# EAGLE design USBSocket_Type1_v1.0 (EAGLE 9.6.2)
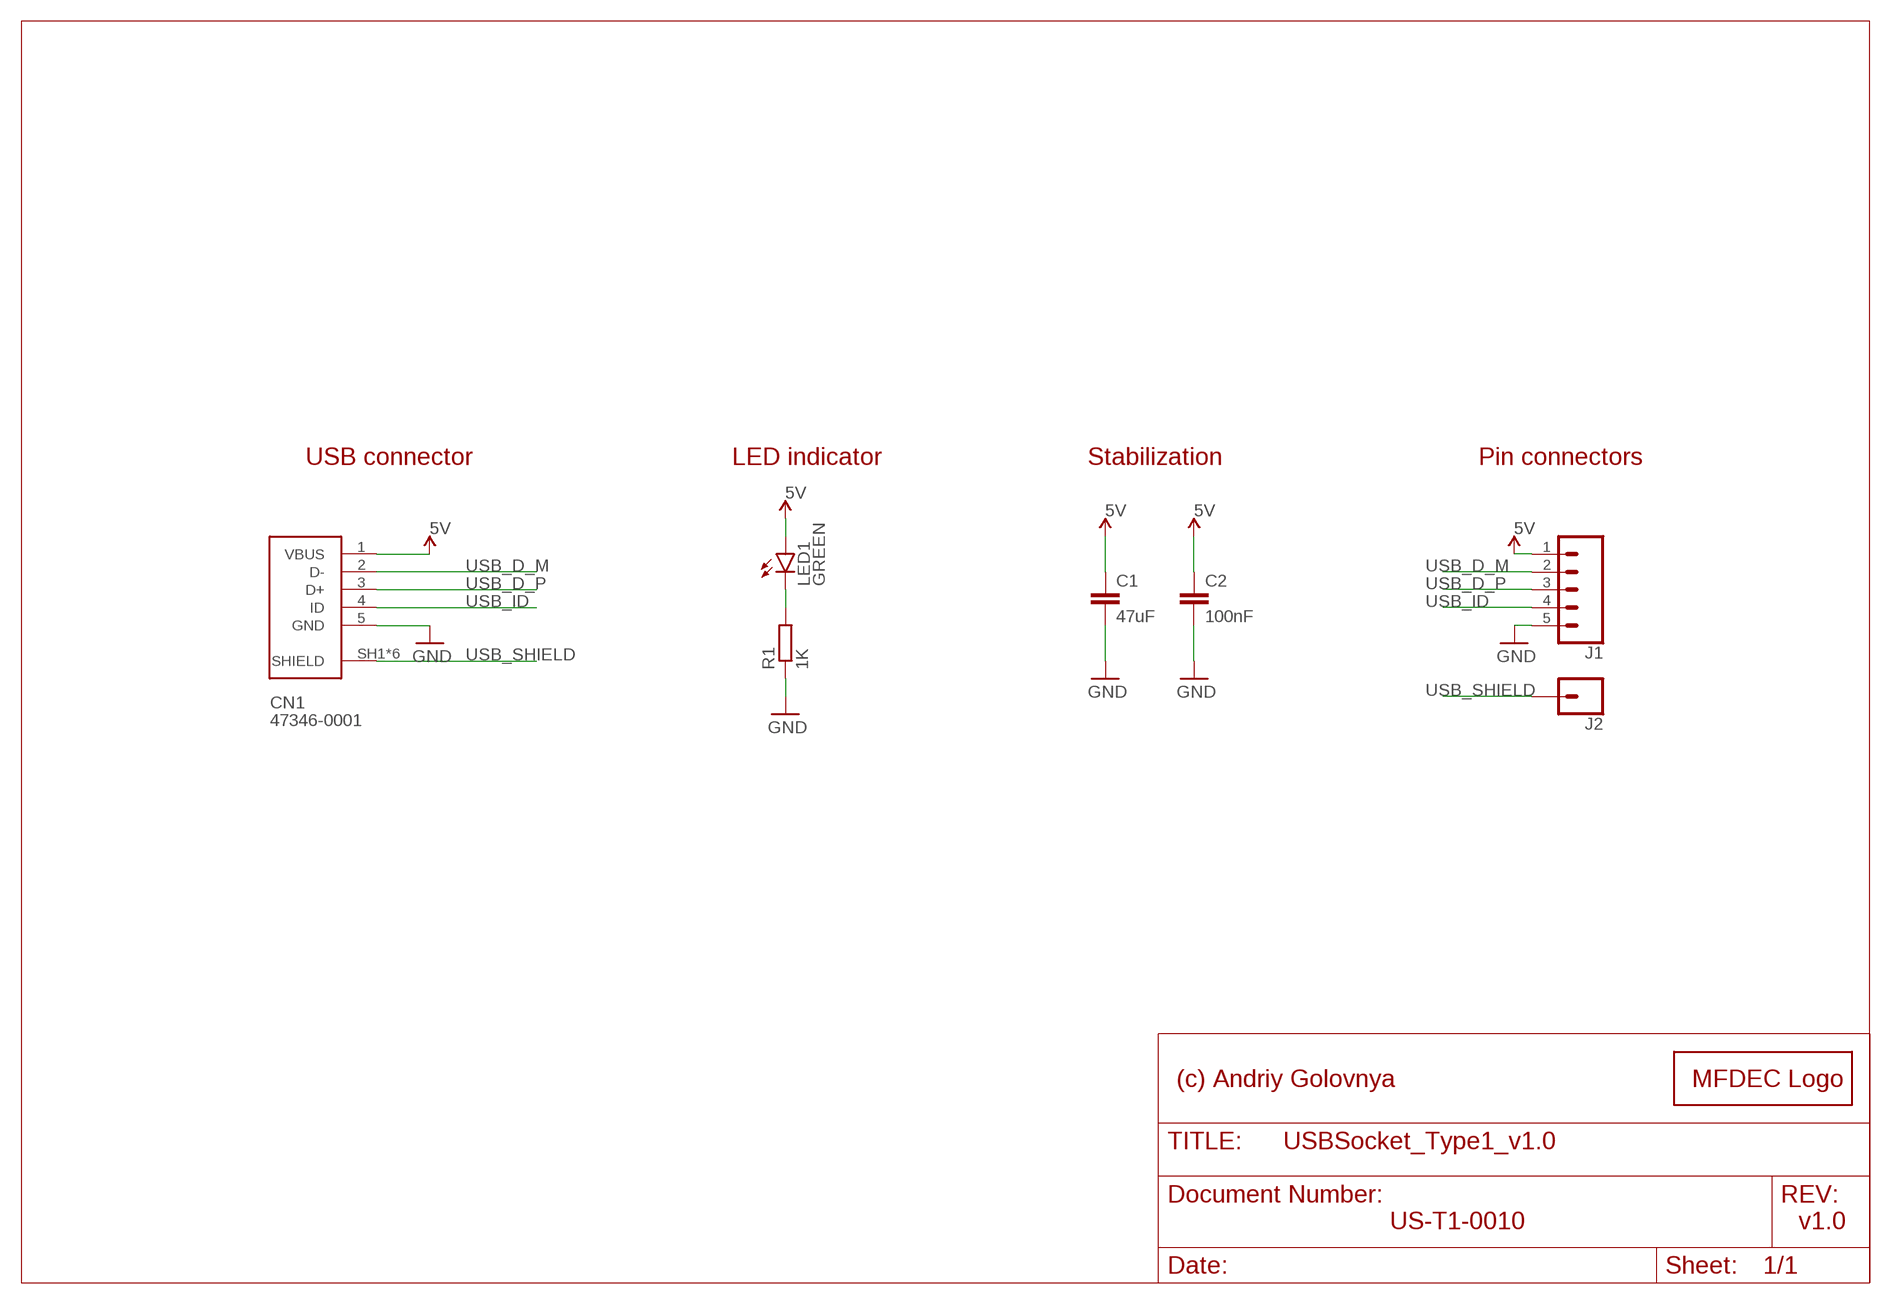
[diagram p0: schematic, sheet 1]

## Parts
C1  47uF  C-EUC0805  [C0805]
C2  100nF  C-EUC0402  [C0402]
CN1  47346-0001  [MOLEX_47346-0001]
J1  CONN_05PTH  [1X05]
J2  CONN_01  [1X01]
LED1  GREEN  LEDSML0603  [SML0603]
LOGO1  MFDECLOGO_L_10MM  [MFDEC_L_10MM]
R1  1K  R-EU_R0402  [R0402]

## Nets
5V [POWER]: C1.1 C2.1 CN1.1(VBUS) J1.1 LED1.A
GND [POWER]: C1.2 C2.2 CN1.5(GND) J1.5 R1.1
N$7: LED1.C R1.2
USB_D_M [XUSB]: CN1.2(D-) J1.2
USB_D_P [XUSB]: CN1.3(D+) J1.3
USB_ID: CN1.4(ID) J1.4
USB_SHIELD: CN1.SH1(SHIELD) CN1.SH2(SHIELD) CN1.SH3(SHIELD) CN1.SH4(SHIELD) CN1.SH5(SHIELD) CN1.SH6(SHIELD) J2.1

## Notes on the sheet
- USB connector | LED indicator | Stabilization | Pin connectors
- (c) Andriy Golovnya
- US-T1-0010 | v1.0

## Library data of the parts
C1 C2 = rcl:C-EU: CAPACITOR, European symbol; SPICEPREFIX: C
CN1 = SnapEDA-Library:47346-0001: CONN RCPT 5POS MICRO USB R/A SMD; MANUFACTURER: Molex
J1 = _my_locked_connectors:CONN_05: Multi connection point. Often used as Generic Header-pin footprint for 0.1 inch spaced/style header connections On any of the 0.1 inch spaced packages, you can populate with these: Break Away Headers - Straight <https://www.sparkfun.com/products/116> (PRT-00116) Break Away Male Headers - Right Angle <https://www.sparkfun.com/products/553> (PRT-00553) Female Headers <https://www.sparkfun.com/products/115> (PRT-00115) Break Away Headers - Machine Pin <https://www.sparkfun.com/products/117> (PRT-00117) Break Away Female Headers - Swiss Machine Pin <https://www.sparkfun.com/products/743> (PRT-00743) For SCREWTERMINALS and SPRING TERMINALS visit here: Screw Terimnals on SparkFun.com <https://www.sparkfun.com/search/results?term=Screw+Terminals> (5mm/3.5mm/2.54mm spacing) This device is also useful as a general connection point to wire up your design to another part of your project. Our various solder wires solder well into these plated through hole pads. Hook-Up Wire - Assortment (Stranded, 22 AWG) <https://www.sparkfun.com/products/11375> (PRT-11375) Hook-Up Wire - Assortment (Solid Core, 22 AWG) <https://www.sparkfun.com/products/11367> (PRT-11367) View the entire wire category on our website here <https://www.sparkfun.com/categories/141> Special notes: Molex polarized connector foot print use with SKU : PRT-08231 with associated crimp pins and housings. 1MM SMD Version SKU: PRT-10208
J2 = SparkFun-Connectors:CONN_01: Single connection point. Often used as Generic Header-pin footprint for 0.1 inch spaced/style header connections On any of the 0.1 inch spaced packages, you can populate with these: Break Away Headers - Straight <https://www.sparkfun.com/products/116> (PRT-00116) Break Away Male Headers - Right Angle <https://www.sparkfun.com/products/553> (PRT-00553) Female Headers <https://www.sparkfun.com/products/115> (PRT-00115) Break Away Headers - Machine Pin <https://www.sparkfun.com/products/117> (PRT-00117) Break Away Female Headers - Swiss Machine Pin <https://www.sparkfun.com/products/743> (PRT-00743) This device is also useful as a general connection point to wire up your design to another part of your project. Our various solder wires solder well into these plated through hole pads. Hook-Up Wire - Assortment (Stranded, 22 AWG) <https://www.sparkfun.com/products/11375> (PRT-11375) Hook-Up Wire - Assortment (Solid Core, 22 AWG) <https://www.sparkfun.com/products/11367> (PRT-11367) View the entire wire category on our website here <https://www.sparkfun.com/categories/141> Special notes: SMTSO-256-ET is a "flush mount" nut for a 4-40 screw. We mostly use this on specialty testbeds; it is a nice way to connect hardware to your PCB at an adjustable hieght. Also note, the SNAP packages are for using a snappable style connector. We sell a baggie of snaps and they are also used on two LilyPad designs: Snap Assortment - 30 pack (male and female) <https://www.sparkfun.com/products/11347> (DEV-11347) LilyPad Arduino SimpleSnap <https://www.sparkfun.com/products/10941> (DEV-10941) LilyPad SimpleSnap Protoboard <https://www.sparkfun.com/products/10940> (DEV-10940)
LED1 = led:LED: LED OSRAM: - CHIPLED LG R971, LG N971, LY N971, LG Q971, LY Q971, LO R971, LY R971 LH N974, LH R974 LS Q976, LO Q976, LY Q976 LO Q996 - Hyper CHIPLED LW Q18S LB Q993, LB Q99A, LB R99A - SideLED LS A670, LO A670, LY A670, LG A670, LP A670 LB A673, LV A673, LT A673, LW A673 LH A674 LY A675 LS A676, LA A676, LO A676, LY A676, LW A676 LS A679, LY A679, LG A679 - Hyper Micro SIDELED® LS Y876, LA Y876, LO Y876, LY Y876 LT Y87S - SmartLED LW L88C, LW L88S LB L89C, LB L89S, LG L890 LS L89K, LO L89K, LY L89K LS L896, LA L896, LO L896, LY L896 - TOPLED LS T670, LO T670, LY T670, LG T670, LP T670 LSG T670, LSP T670, LSY T670, LOP T670, LYG T670 LG T671, LOG T671, LSG T671 LB T673, LV T673, LT T673, LW T673 LH T674 LS T676, LA T676, LO T676, LY T676, LB T676, LH T676, LSB T676, LW T676 LB T67C, LV T67C, LT T67C, LS T67K, LO T67K, LY T67K, LW E67C LS E67B, LA E67B, LO E67B, LY E67B, LB E67C, LV E67C, LT E67C LW T67C LS T679, LY T679, LG T679 LS T770, LO T770, LY T770, LG T770, LP T770 LB T773, LV T773, LT T773, LW T773 LH T774 LS E675, LA E675, LY E675, LS T675 LS T776, LA T776, LO T776, LY T776, LB T776 LHGB T686 LT T68C, LB T68C - Hyper Mini TOPLED® LB M676 - Mini TOPLED Santana® LG M470 LS M47K, LO M47K, LY M47K Source: http://www.osram.convergy.de LUXEON: - LUMILED® LXK2-PW12-R00, LXK2-PW12-S00, LXK2-PW14-U00, LXK2-PW14-V00 LXK2-PM12-R00, LXK2-PM12-S00, LXK2-PM14-U00 LXK2-PE12-Q00, LXK2-PE12-R00, LXK2-PE12-S00, LXK2-PE14-T00, LXK2-PE14-U00 LXK2-PB12-K00, LXK2-PB12-L00, LXK2-PB12-M00, LXK2-PB14-N00, LXK2-PB14-P00, LXK2-PB14-Q00 LXK2-PR12-L00, LXK2-PR12-M00, LXK2-PR14-Q00, LXK2-PR14-R00 LXK2-PD12-Q00, LXK2-PD12-R00, LXK2-PD12-S00 LXK2-PH12-R00, LXK2-PH12-S00 LXK2-PL12-P00, LXK2-PL12-Q00, LXK2-PL12-R00 Source: www.luxeon.com KINGBRIGHT: KA-3528ASYC Source: www.kingbright.com
LOGO1 = _my_logos:MFDECLOGO: Midnight Fog - Digital Eye Candy LOGO
R1 = rcl:R-EU_: RESISTOR, European symbol; SPICEPREFIX: R

## Net classes
1 XUSB: width 0.305 mm
2 USB: width 0.305 mm
3 POWER: width 0.305 mm

## Board
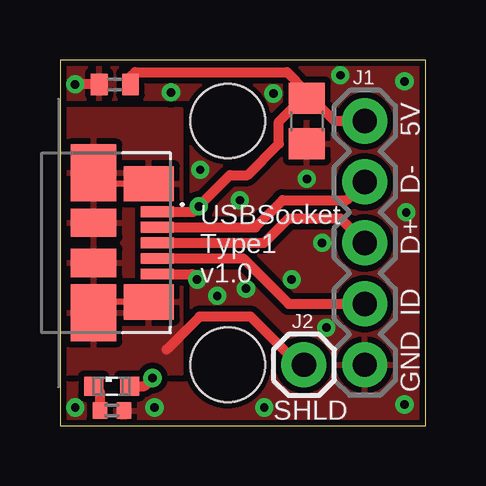
[diagram p1: board, top side]
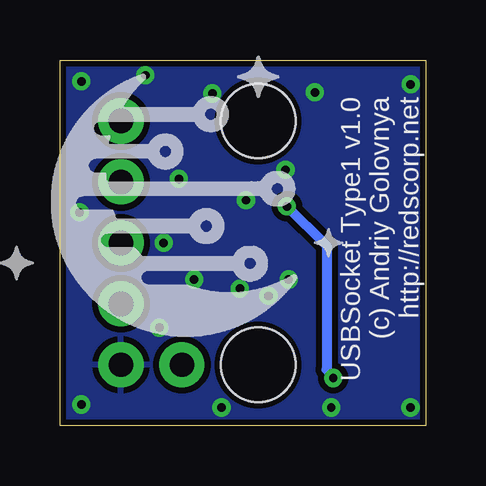
[diagram p2: board, bottom side, seen from below]

Size 15.24 x 15.24 mm. Coordinates in mm from the lower left corner, seen from the top.
Outline: 0,0 15.24,0 15.24,15.24 0,15.24 0,0
Copper layers (1*16): Top 0.035mm / dielectric 1.5mm / Bottom 0.035mm
Design rules "default *": minimum track width 6mil, minimum drill 0.35mm, track to track 6mil, track to pad 6mil, pad to pad 6mil, via to via 6mil, smd to smd 6mil, copper to edge 10mil, drill to drill 6mil, minimum pad ring 10mil, minimum via ring 8mil, stop-mask expansion 4mil, vias tented up to drill 20mil, thermal gap 10mil
Holes 3.1 mm at 6.99,2.54 6.99,12.7

### Footprints (pad centres in the part's own frame; a part is rotated, then mirrored left to right if it is on the bottom)
C0805 = smd 1.3 x 1.5: 1 -0.95,0; 2 0.95,0
C0402 = smd 0.7 x 0.9: 1 -0.65,0; 2 0.65,0
MOLEX_47346-0001 = smd 0.45 x 1.38: 1 -1.3,2.66; 2 -0.65,2.66; 3 0,2.66; 4 0.65,2.66; 5 1.3,2.66 | smd 1.475 x 2.1: SH1 -2.462,2.3; SH2 2.462,2.3 | smd 2.375 x 1.9: SH3 -2.913,0; SH6 2.913,0 | smd 1.175 x 1.9: SH4 -0.838,0; SH5 0.838,0
1X05 = drill 1.016 pad 1.88: 1 0,0; 2 2.54,0; 3 5.08,0; 4 7.62,0; 5 10.16,0
1X01 = drill 1.016 pad 1.88: 1 0,0
SML0603 = smd 0.8 x 0.8: A 0.75,0; C -0.75,0
R0402 = smd 0.6 x 0.7: 1 -0.5,0; 2 0.5,0

### Placement (x,y rotation side)
C1  10.29,12.7 270 top
C2  2.29,14.22 180 top
CN1  1.4,7.62 270 top
J1  12.7,12.7 270 top
J2  10.16,2.54 0 top
LED1  2.16,1.65 0 top
LOGO1  18.54,2.79 0 bottom  (outside the outline)
R1  2.16,0.64 180 top

### Tracks (layer width: path | path; a pad name or v marks a point on that pad's centre or on a via)
5V  (via drill 0.35)
  Top 0.406: CN1.1 5.59,8.92 5.79,9.12 v5.79,9.14 7.08,10.44 7.82,10.44 9.12,11.74 9.12,12.68 10.09,13.65 C1.1 | C2.1 2.94,14.54 3.13,14.73 9.46,14.73 10.29,13.9 C1.1 | v3.85,1.99 3.52,1.65 LED1.A | C1.1 10.48,13.65 11.43,12.7 J1.1
  Bottom 0.406: v5.79,9.14 4.13,7.49 4.13,2.34 3.85,2.06 v3.85,1.99
GND  (via drill 0.35)
  Top 0.406: C2.2 v0.63,14.22 | v5.71,6.1 5.49,6.32 CN1.5
  other vias: 11.1,4.09 3.94,0.76 14.35,0.89 14.35,14.35 14.43,8.89 7.49,9.4 10.29,10.29 4.62,13.89 5.84,10.67 8.89,13.84 8.51,0.76 11.68,14.61 9.65,6.1 10.92,7.62 0.64,0.76 7.75,5.71 6.55,5.41
  pour Top (isolate 0.254, rank 2): 0,0 21.34,0 21.34,15.24 0,15.24
  pour Bottom (isolate 0.254, rank 2): 0,0 18.16,0 18.16,15.24 0,15.24
N$7
  Top 0.406: LED1.C 1.66,1.4 R1.2
USB_D_M
  Top 0.406: CN1.2 8.14,8.27 9.27,9.4 11.94,9.4 J1.2
USB_D_P
  Top 0.406: CN1.3 8.51,7.62 9.53,8.64 11.68,8.64 J1.3
USB_ID
  Top 0.406: CN1.4 7.63,6.97 9.53,5.08 J1.4
USB_SHIELD
  Top 0.254: CN1.SH1 1.85,10.08 CN1.SH3 | CN1.SH2 1.85,5.16 CN1.SH6
  Top 0.406: J2.1 9.95,2.54 7.94,4.55 5.82,4.55 4.45,3.17
  pour Top (isolate 0.254): 3.05,9.4 5.08,9.4 5.08,13.21 0,13.21 0,2.16 5.08,2.16 5.08,5.84 3.05,5.84

### Text on the board
tPlace: 5V | D- | D+ | USBSocket / Type1 / v1.0 | ID | GND | SHLD
bPlace: USBSocket Type1 v1.0 / (c) Andriy Golovnya / http://redscorp.net